# Altium schematic sheet uMultimeter_LED_Sch.SchDoc: MicroMultimeter - LED
size 127 x 101 mm; Author: Hom; CompanyName: KitSprout; DrawnBy: Hom; Engineer: Hom; Organization: KitSprout; Revision: B; SheetNumber: 1; SheetTotal: 1; License: CC BY-SA 4.0; Version: 2.0; LibVersion: 2.1; PageSetup: Record=PageOptions|CenterHorizontal=True|CenterVertical=True|PrintScale=1.00|XCorrection=1.00|YCorrection=1.00|PrintKind=0|BorderSize=5000000|LeftOffset=0|BottomOffset=0|Orientation=2|PaperLength=1000|PaperWidth=1000|Scale=100|PaperSource=7|PrintQuality=-3|MediaType=1|DitherType=10|PrintScaleMode=0|PaperKind=A4|PaperIndex=9
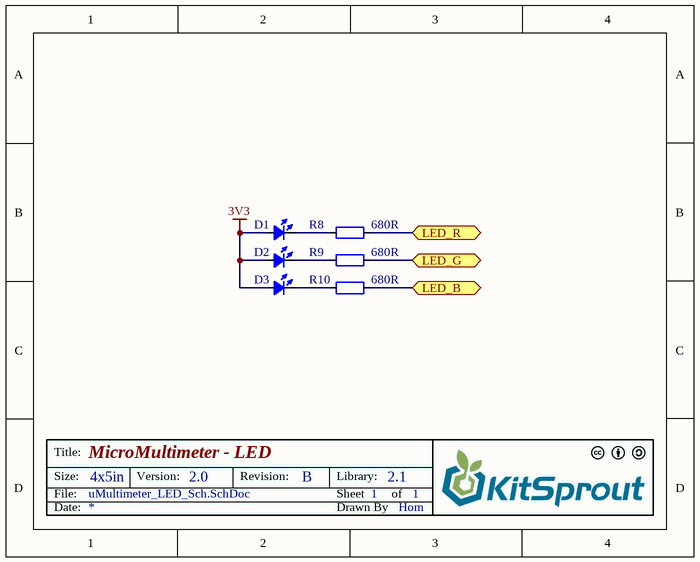
[diagram p0: uMultimeter_LED_Sch.SchDoc]

## Parts
D1  LED_0805  [LED_0805_RED]  (value not drawn)
D2  LED_0805  [LED_0805_GREEN]  (value not drawn)
D3  LED_0805  [LED_0805_BLUE]  (value not drawn)
R8  value 680R  [RES_0603]  (hidden comment: Res_0603)
R9  value 680R  [RES_0603]  (hidden comment: Res_0603)
R10  value 680R  [RES_0603]  (hidden comment: Res_0603)

## Ports
LED_B, LED_G, LED_R

## Nets
3V3: D1.1(A) D2.1(A) D3.1(A)
LED_B: R10.2 ; port LED_B
LED_G: R9.1 ; port LED_G
LED_R: R8.1 ; port LED_R
NetD1_2: D1.2(K) R8.2
NetD2_2: D2.2(K) R9.2
NetD3_2: D3.2(K) R10.1

## Notes on the sheet
- Title:
- Size:
- Date:
- File:
- 4x5in
- Version:
- Revision:
- Sheet
- Drawn By
- Library:
- of

## Library data of the parts
D1-D3 = LED_0805: LED
R8-R10 = Res_0603: Resistor